# EasyEDA Pro project STM Embedded BD.eprj, board PCB2
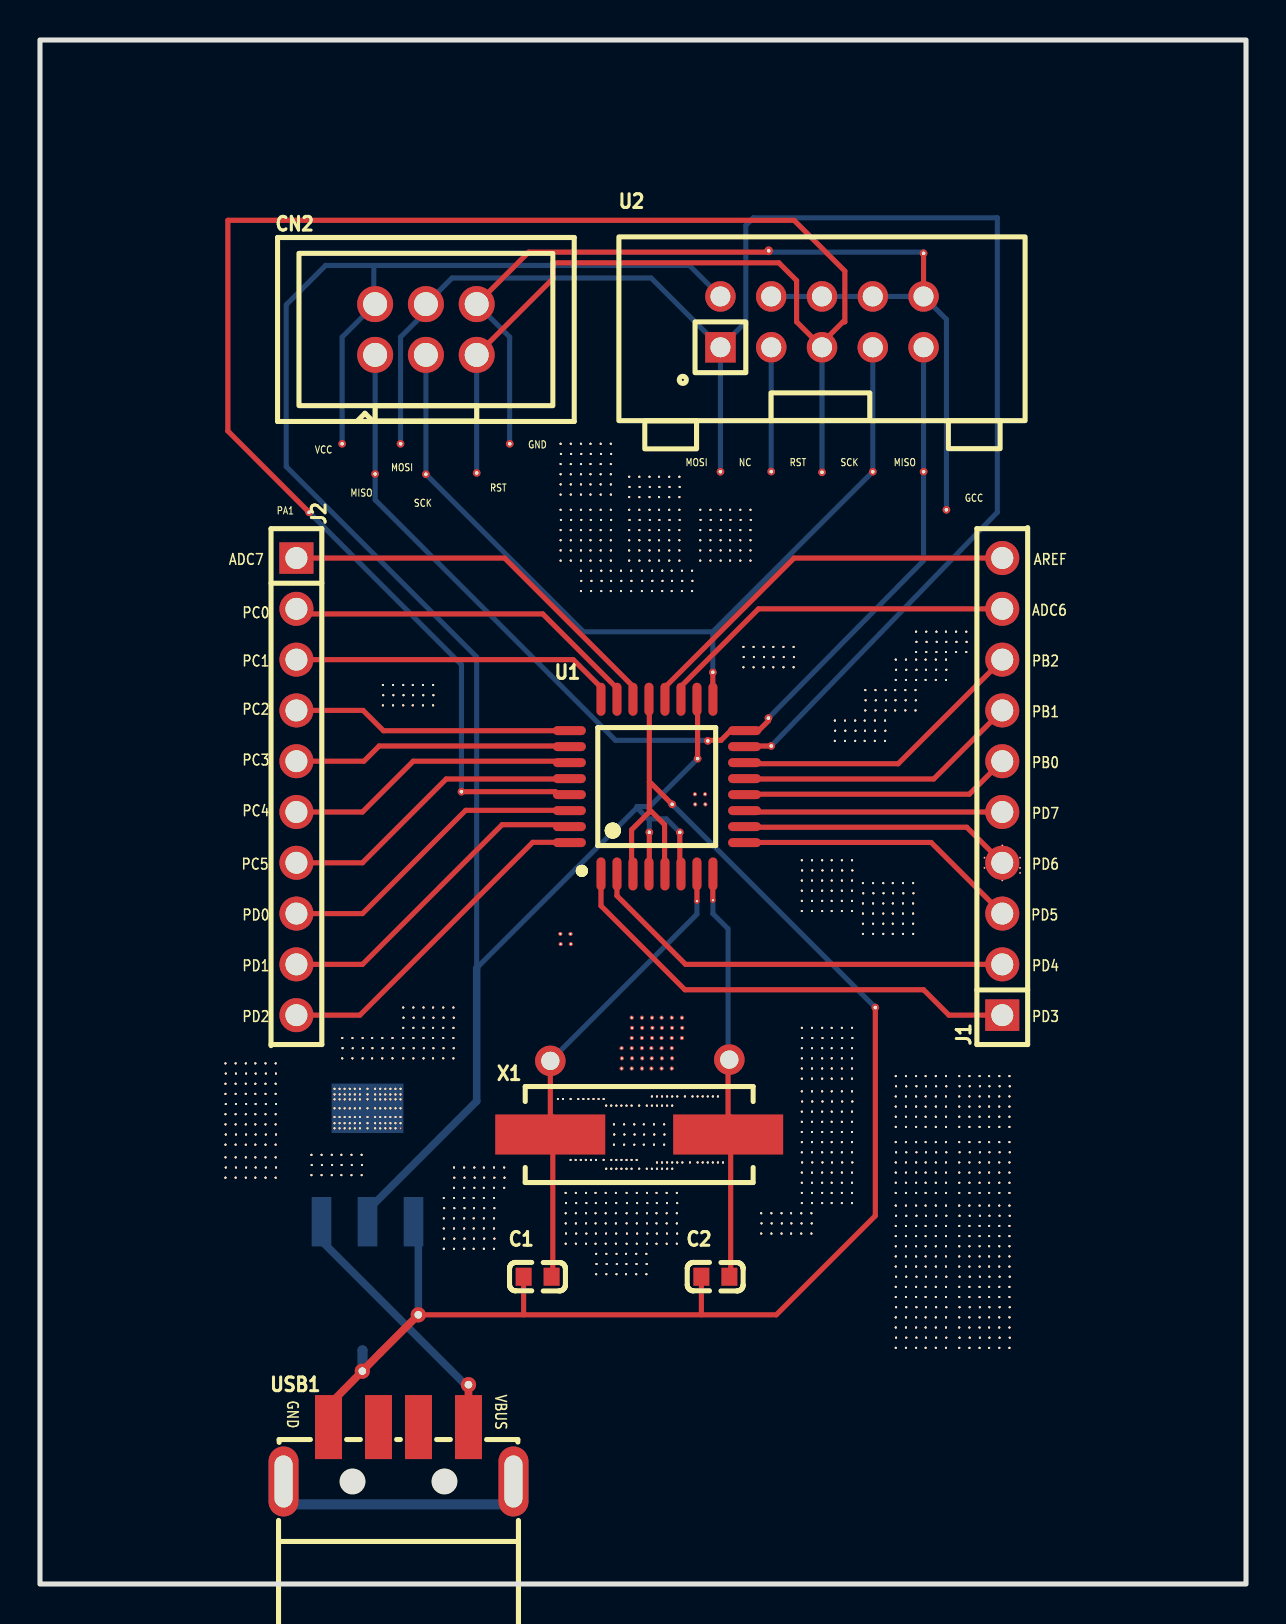
[diagram p4: board, top side]
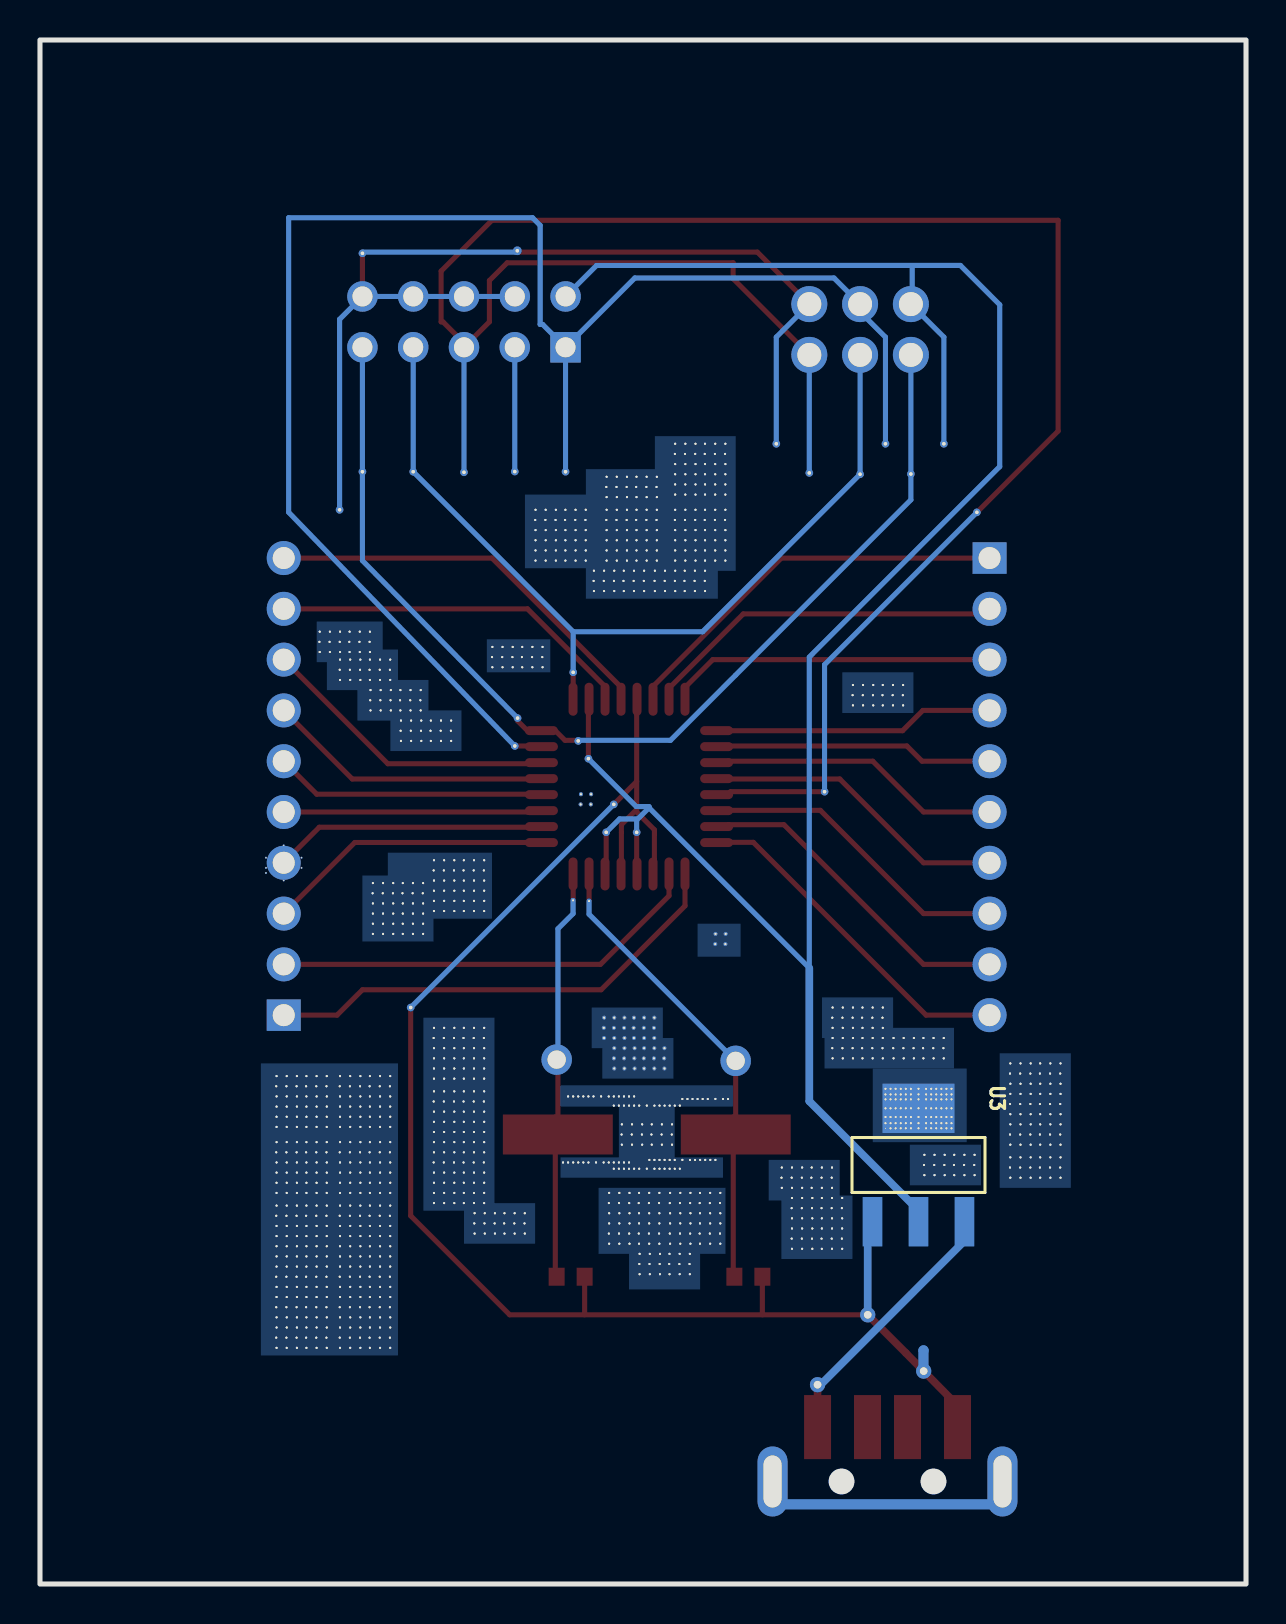
[diagram p5: board, bottom side, seen from below]

Outline 60.32 x 77.22 mm; copper layers: Top Layer, Bottom Layer. Coordinates in mm from the lower left corner of the outline.
Outline path: rectangle 0,77.22 60.32,0
Stack: Top Layer 0.035mm - / Dielectric1 1.51mm FR4 er 4.5 / Bottom Layer 0.035mm -

## Design rules (mm)
template: JLCPCB Capability(Two Layers Board)
spacing copperThickness1oz (default): track to track 0.102, other pairs 0.152 to 0.3
spacing copperThickness2oz: track to track 0.203, other pairs 0.152 to 0.3
track width copperThickness1oz (default): min 0.127, default 0.254, max 2.54
track width copperThickness2oz: min 0.203, default 0.254, max 2.54
differential pair differentialPair (default): width min 0.127, default 0.254, max 2.54; gap min 0.152, default 0.152
via viaSize (default): diameter min 0.5, default 0.61, max 10; hole min 0.3, default 0.305, max 6.3

## Placement (name value [footprint] x y rotation side)
C1  22pF  [C0603]  24.89 15.37 0 top
C2  22pF  [C0603]  33.78 15.37 0 top
CN2  75869-131LF  [CONN-TH_6P-P2.54_75869-131LF]  19.3 62.74 0 top
J1  PZ254-1-10-Z-8.5  [HDR-TH_10P-P2.54-V-M]  48.13 39.88 90 top
J2  PZ254-1-10-Z-8.5  [HDR-TH_10P-P2.54-V-M]  12.83 39.88 270 top
NOREF  -  [Pad_e1230]  30.49 55.37 0 top
NOREF#2  -  [Pad_e957]  28.81 18.54 0 top
NOREF#3  -  [Pad_e325]  45.98 22.1 0 top
NOREF#4  -  [Pad_e1079]  46.49 14.86 0 top
NOREF#5  -  [Pad_e610]  38.62 26.8 0 top
NOREF#6  -  [Pad_e497]  28.04 53.72 0 top
NOREF#7  -  [Pad_e1527]  27.84 16 0 top
NOREF#8  -  [Pad_e822]  27.81 21.21 0 top
NOREF#9  -  [Pad_e817]  26.54 21.21 0 top
NOREF#10  -  [Pad_e44]  42.18 33.02 0 top
NOREF#11  -  [Pad_e963]  31.85 19.56 0 top
NOREF#12  -  [Pad_e595]  34.52 51.69 0 top
NOREF#13  -  [Pad_e1208]  29.06 49.66 0 top
NOREF#14  -  [Pad_e850]  38.11 21.59 0 top
NOREF#15  -  [Pad_e1427]  9.79 22.99 0 top
NOREF#16  -  [Pad_e380]  44.81 16.89 0 top
NOREF#17  -  [Pad_e310]  45.32 19.56 0 top
NOREF#18  -  [Pad_e461]  28.04 57.02 0 top
NOREF#19  -  [Pad_e324]  46.49 22.1 0 top
NOREF#20  -  [Pad_e994]  29.34 18.03 0 top
NOREF#21  -  [Pad_e109]  44.81 23.88 0 top
NOREF#22  -  [Pad_e58]  43.67 32.51 0 top
NOREF#23  -  [Pad_e777]  38.12 24.13 0 top
NOREF#24  -  [Pad_e1325]  45.84 47.12 0 top
NOREF#25  -  [Pad_e1025]  43.31 14.86 0 top
NOREF#26  -  [Pad_e744]  26.16 24.26 0 top
NOREF#27  -  [Pad_e1284]  42.3 44.7 0 top
NOREF#28  -  [Pad_e1070]  47.98 15.88 0 top
NOREF#29  -  [Pad_e1055]  44.82 12.32 0 top
NOREF#30  -  [Pad_e962]  31.35 19.56 0 top
NOREF#31  -  [Pad_e796]  31.88 24.38 0 top
NOREF#32  -  [Pad_e858]  39.12 20.57 0 top
NOREF#33  -  [Pad_e871]  39.6 20.07 0 top
NOREF#34  -  [Pad_e189]  48.49 23.88 0 top
NOREF#35  -  [Pad_e1262]  19.16 43.94 0 top
NOREF#36  -  [Pad_e1029]  45.32 14.86 0 top
NOREF#37  -  [Pad_e615]  40.11 27.81 0 top
NOREF#38  -  [Pad_e523]  27.54 51.69 0 top
NOREF#39  -  [Pad_e663]  15.24 24.48 0 top
NOREF#40  -  [Pad_e1202]  27.58 50.17 0 top
NOREF#41  -  [Pad_e1299]  43.79 43.69 0 top
NOREF#42  -  [Pad_e152]  48.51 24.89 0 top
NOREF#43  -  [Pad_e1265]  40.27 43.18 0 top
NOREF#44  -  [Pad_e419]  47.98 16.38 0 top
NOREF#45  -  [Pad_e502]  27.07 53.21 0 top
NOREF#46  -  [Pad_e1584]  37.09 17.53 0 top
NOREF#47  -  [Pad_e291]  43.33 21.59 0 top
NOREF#48  -  [Pad_e742]  38.63 24.13 0 top
NOREF#49  -  [Pad_e930]  30.22 22.48 0 top
NOREF#50  -  [Pad_e1388]  17.12 26.29 0 top
NOREF#51  -  [Pad_e570]  35.54 53.72 0 top
NOREF#52  -  [Pad_e336]  47.48 20.57 0 top
NOREF#53  -  [Pad_e1135]  30.59 25.78 0 top
NOREF#54  -  [Pad_e392]  48 18.42 0 top
NOREF#55  -  [Pad_e1491]  20.72 20.32 0 top
NOREF#56  -  [Pad_e845]  38.62 22.1 0 top
NOREF#57  -  [Pad_e24]  43.17 34.04 0 top
NOREF#58  -  [Pad_e123]  15.11 57.02 0 top
NOREF#59  -  [Pad_e684]  17.78 24.24 0 top
NOREF#60  -  [Pad_e376]  42.81 16.89 0 top
NOREF#61  -  [Pad_e377]  43.31 16.89 0 top
NOREF#62  -  [Pad_e671]  17.78 24.48 0 top
NOREF#63  -  [Pad_e331]  47.48 21.08 0 top
NOREF#64  -  [Pad_e1477]  21.69 18.29 0 top
NOREF#65  -  [Pad_e80]  43.84 24.89 0 top
NOREF#66  -  [Pad_e797]  32.64 24.38 0 top
NOREF#67  -  [Pad_e1505]  22.22 17.27 0 top
NOREF#68  -  [Pad_e592]  33.03 51.69 0 top
NOREF#69  -  [Pad_e1338]  19.18 27.31 0 top
NOREF#70  -  [Pad_e728]  15.24 22.79 0 top
NOREF#71  -  [Pad_e1200]  28.57 50.17 0 top
NOREF#72  -  [Pad_e192]  47.98 23.88 0 top
NOREF#73  -  [Pad_e1357]  19.66 28.83 0 top
NOREF#74  -  [Pad_e1481]  21.22 20.83 0 top
NOREF#75  -  [Pad_e1248]  18.17 44.96 0 top
NOREF#76  -  [Pad_e1431]  11.79 22.99 0 top
NOREF#77  -  [Pad_e562]  31.98 51.18 0 top
NOREF#78  -  [Pad_e290]  42.82 21.59 0 top
NOREF#79  -  [Pad_e1390]  9.28 26.04 0 top
NOREF#80  -  [Pad_e1429]  10.77 22.99 0 top
NOREF#81  -  [Pad_e55]  42.18 32.51 0 top
NOREF#82  -  [Pad_e565]  30.49 51.18 0 top
NOREF#83  -  [Pad_e1333]  45.32 46.61 0 top
NOREF#84  -  [Pad_e149]  48.49 25.4 0 top
NOREF#85  -  [Pad_e57]  43.17 32.51 0 top
NOREF#86  -  [Pad_e1244]  31.47 54.36 0 top
NOREF#87  -  [Pad_e1499]  20.71 17.78 0 top
NOREF#88  -  [Pad_e1024]  42.81 14.86 0 top
NOREF#89  -  [Pad_e349]  47 19.56 0 top
NOREF#90  -  [Pad_e1493]  21.22 19.81 0 top
NOREF#91  -  [Pad_e389]  47.98 18.92 0 top
NOREF#92  -  [Pad_e1086]  47 14.35 0 top
NOREF#93  -  [Pad_e1417]  10.31 24 0 top
NOREF#94  -  [Pad_e1577]  38.09 18.03 0 top
NOREF#95  -  [Pad_e947]  28.31 19.05 0 top
NOREF#96  -  [Pad_e828]  29.84 21.21 0 top
NOREF#97  -  [Pad_e788]  40.62 23.62 0 top
NOREF#98  -  [Pad_e481]  27.06 55.5 0 top
NOREF#99  -  [Pad_e1296]  42.3 43.69 0 top
NOREF#100  -  [Pad_e642]  47.24 36.32 0 top
NOREF#101  -  [Pad_e1253]  19.17 44.45 0 top
NOREF#102  -  [Pad_e1063]  44.3 11.81 0 top
NOREF#103  -  [Pad_e810]  32.89 21.08 0 top
NOREF#104  -  [Pad_e1228]  29.47 55.37 0 top
NOREF#105  -  [Pad_e564]  30.97 51.18 0 top
NOREF#106  -  [Pad_e621]  38.11 26.29 0 top
NOREF#107  -  [Pad_e800]  33.4 24.38 0 top
NOREF#108  -  [Pad_e1185]  35.2 46.36 0 top
NOREF#109  -  [Pad_e630]  39.12 25.78 0 top
NOREF#110  -  [Pad_e569]  35.03 53.72 0 top
NOREF#111  -  [Pad_e649]  15.24 24.77 0 top
NOREF#112  -  [Pad_e1066]  45.98 15.88 0 top
NOREF#113  -  [Pad_e1410]  10.29 24.51 0 top
NOREF#114  -  [Pad_e423]  45.98 16.38 0 top
NOREF#115  -  [Pad_e328]  45.98 21.08 0 top
NOREF#116  -  [Pad_e991]  27.79 17.02 0 top
NOREF#117  -  [Pad_e442]  38.62 34.67 0 top
NOREF#118  -  [Pad_e1305]  45.32 46.23 0 top
NOREF#119  -  [Pad_e372]  44.3 17.4 0 top
NOREF#120  -  [Pad_e1406]  11.28 25.02 0 top
NOREF#121  -  [Pad_e1251]  19.66 44.96 0 top
NOREF#122  -  [Pad_e549]  31.98 52.71 0 top
NOREF#123  -  [Pad_e318]  48.49 22.1 0 top
NOREF#124  -  [Pad_e1287]  43.79 44.7 0 top
NOREF#125  -  [Pad_e1382]  15.64 26.8 0 top
NOREF#126  -  [Pad_e1091]  48 13.84 0 top
NOREF#127  -  [Pad_e1362]  19.68 28.32 0 top
NOREF#128  -  [Pad_e700]  14.73 23.35 0 top
NOREF#129  -  [Pad_e1239]  29.49 54.86 0 top
NOREF#130  -  [Pad_e1593]  26.54 32.51 0 top
NOREF#131  -  [Pad_e1353]  20.68 26.29 0 top
NOREF#132  -  [Pad_e769]  29.34 23.92 0 top
NOREF#133  -  [Pad_e705]  16 23.35 0 top
NOREF#134  -  [Pad_e462]  28.55 57.02 0 top
NOREF#135  -  [Pad_e1093]  47.01 13.84 0 top
NOREF#136  -  [Pad_e602]  33.54 51.18 0 top
NOREF#137  -  [Pad_e360]  43.31 18.92 0 top
NOREF#138  -  [Pad_e443]  39.12 34.67 0 top
NOREF#139  -  [Pad_e1047]  45.32 13.34 0 top
NOREF#140  -  [Pad_e692]  16 23.79 0 top
NOREF#141  -  [Pad_e1533]  30.33 15.49 0 top
NOREF#142  -  [Pad_e1482]  21.72 20.83 0 top
NOREF#143  -  [Pad_e622]  38.62 26.29 0 top
NOREF#144  -  [Pad_e2356]  32.86 34.15 0 top
NOREF#145  -  [Pad_e138]  44.81 22.86 0 top
NOREF#146  -  [Pad_e412]  45.98 16.89 0 top
NOREF#147  -  [Pad_e469]  26.04 57.02 0 top
NOREF#148  -  [Pad_e720]  17.02 23.04 0 top
NOREF#149  -  [Pad_e1443]  11.79 21.97 0 top
NOREF#150  -  [Pad_e1367]  18.68 27.81 0 top
NOREF#151  -  [Pad_e1133]  29.6 25.78 0 top
NOREF#152  -  [Pad_e1268]  41.76 43.18 0 top
NOREF#153  -  [Pad_e702]  15.24 23.35 0 top
NOREF#154  -  [Pad_e1279]  41.25 42.16 0 top
NOREF#155  -  [Pad_e1511]  20.71 16.76 0 top
NOREF#156  -  [Pad_e413]  46.49 16.89 0 top
NOREF#157  -  [Pad_e1259]  17.66 43.94 0 top
NOREF#158  -  [Pad_e541]  29.47 53.72 0 top
NOREF#159  -  [Pad_e1508]  20.72 17.27 0 top
NOREF#160  -  [Pad_e525]  28.55 51.69 0 top
NOREF#161  -  [Pad_e1356]  19.18 28.83 0 top
NOREF#162  -  [Pad_e282]  45.32 22.1 0 top
NOREF#163  -  [Pad_e329]  46.49 21.08 0 top
NOREF#164  -  [Pad_e1003]  30.38 17.53 0 top
NOREF#165  -  [Pad_e1007]  29.85 17.02 0 top
NOREF#166  -  [Pad_e515]  28.04 52.2 0 top
NOREF#167  -  [Pad_e198]  47.48 23.88 0 top
NOREF#168  -  [Pad_e393]  47.49 18.42 0 top
NOREF#169  -  [Pad_e385]  43.82 16.38 0 top
NOREF#170  -  [Pad_e1237]  30.5 54.86 0 top
NOREF#171  -  [Pad_e1446]  10.29 21.34 0 top
NOREF#172  -  [Pad_e563]  31.47 51.18 0 top
NOREF#173  -  [Pad_e382]  45.32 16.38 0 top
NOREF#174  -  [Pad_e1302]  43.82 46.23 0 top
NOREF#175  -  [Pad_e1243]  30.97 54.36 0 top
NOREF#176  -  [Pad_e1152]  30.61 27.31 0 top
NOREF#177  -  [Pad_e757]  29.59 20.77 0 top
NOREF#178  -  [Pad_e172]  45.98 25.4 0 top
NOREF#179  -  [Pad_e305]  43.31 20.07 0 top
NOREF#180  -  [Pad_e712]  16.38 23.05 0 top
NOREF#181  -  [Pad_e660]  16.38 24.49 0 top
NOREF#182  -  [Pad_e399]  46.5 18.42 0 top
NOREF#183  -  [Pad_e724]  18.03 23.04 0 top
NOREF#184  -  [Pad_e453]  38.11 33.66 0 top
NOREF#185  -  [Pad_e103]  32.89 41.28 0 top
NOREF#186  -  [Pad_e1179]  37.7 46.86 0 top
NOREF#187  -  [Pad_e710]  17.78 23.35 0 top
NOREF#188  -  [Pad_e1436]  9.8 22.48 0 top
NOREF#189  -  [Pad_e675]  14.99 24.24 0 top
NOREF#190  -  [Pad_e368]  44.81 17.91 0 top
NOREF#191  -  [Pad_e397]  45.98 18.92 0 top
NOREF#192  -  [Pad_e311]  44.81 19.56 0 top
NOREF#193  -  [Pad_e1168]  13.58 20.45 0 top
NOREF#194  -  [Pad_e1515]  22.71 16.76 0 top
NOREF#195  -  [Pad_e704]  15.75 23.35 0 top
NOREF#196  -  [Pad_e669]  17.27 24.48 0 top
NOREF#197  -  [Pad_e1271]  41.78 42.67 0 top
NOREF#198  -  [Pad_e1369]  19.66 27.81 0 top
NOREF#199  -  [Pad_e1408]  9.28 24.51 0 top
NOREF#200  -  [Pad_e1141]  31.09 28.32 0 top
NOREF#201  -  [Pad_e186]  36.44 43.3 0 top
NOREF#202  -  [Pad_e1464]  21.22 19.3 0 top
NOREF#203  -  [Pad_e390]  48.49 18.92 0 top
NOREF#204  -  [Pad_e1589]  33.27 39.5 0 top
NOREF#205  -  [Pad_e373]  43.82 17.4 0 top
NOREF#206  -  [Pad_e496]  27.54 53.72 0 top
NOREF#207  -  [Pad_e1399]  10.31 25.53 0 top
NOREF#208  -  [Pad_e1064]  44.81 11.81 0 top
NOREF#209  -  [Pad_e966]  30.85 19.05 0 top
NOREF#210  -  [Pad_e452]  38.11 34.16 0 top
NOREF#211  -  [Pad_e1294]  41.28 43.69 0 top
NOREF#212  -  [Pad_e928]  31.23 22.48 0 top
NOREF#213  -  [Pad_e185]  33.4 42.16 0 top
NOREF#214  -  [Pad_e1035]  45.32 14.35 0 top
NOREF#215  -  [Pad_e1124]  31.09 26.8 0 top
NOREF#216  -  [Pad_e1178]  37.19 46.86 0 top
NOREF#217  -  [Pad_e474]  27.06 56.01 0 top
NOREF#218  -  [Pad_e1514]  22.2 16.76 0 top
NOREF#219  -  [Pad_e1400]  9.8 25.53 0 top
NOREF#220  -  [Pad_e865]  40.62 21.59 0 top
NOREF#221  -  [Pad_e716]  15.49 23.04 0 top
NOREF#222  -  [Pad_e500]  28.06 53.21 0 top
NOREF#223  -  [Pad_e306]  43.82 20.07 0 top
NOREF#224  -  [Pad_e1046]  44.81 13.34 0 top
NOREF#225  -  [Pad_e378]  43.82 16.89 0 top
NOREF#226  -  [Pad_e838]  40.62 22.61 0 top
NOREF#227  -  [Pad_e860]  39.62 21.08 0 top
NOREF#228  -  [Pad_e1273]  40.79 42.67 0 top
NOREF#229  -  [Pad_e1307]  44.82 45.72 0 top
NOREF#230  -  [Pad_e761]  31.12 20.77 0 top
NOREF#231  -  [Pad_e1512]  21.22 16.76 0 top
NOREF#232  -  [Pad_e366]  43.82 17.91 0 top
NOREF#233  -  [Pad_e556]  29.47 51.69 0 top
NOREF#234  -  [Pad_e1068]  47 15.88 0 top
NOREF#235  -  [Pad_e22]  42.18 34.04 0 top
NOREF#236  -  [Pad_e1403]  9.79 25.02 0 top
NOREF#237  -  [Pad_e596]  35.03 51.69 0 top
NOREF#238  -  [Pad_e1459]  10.77 20.32 0 top
NOREF#239  -  [Pad_e1513]  21.69 16.76 0 top
NOREF#240  -  [Pad_e1215]  32.62 50.67 0 top
NOREF#241  -  [Pad_e603]  33.03 51.18 0 top
NOREF#242  -  [Pad_e520]  26.04 51.69 0 top
NOREF#243  -  [Pad_e645]  48.13 35.19 0 top
NOREF#244  -  [Pad_e1349]  18.68 26.29 0 top
NOREF#245  -  [Pad_e409]  47 17.4 0 top
NOREF#246  -  [Pad_e926]  30.71 22.99 0 top
NOREF#247  -  [Pad_e213]  21.08 39.62 0 top
NOREF#248  -  [Pad_e703]  15.49 23.35 0 top
NOREF#249  -  [Pad_e1218]  31.62 50.17 0 top
NOREF#250  -  [Pad_e968]  29.87 19.05 0 top
NOREF#251  -  [Pad_e106]  44.81 24.38 0 top
NOREF#252  -  [Pad_e64]  42.18 35.05 0 top
NOREF#253  -  [Pad_e1378]  17.65 26.8 0 top
NOREF#254  -  [Pad_e417]  48.49 16.89 0 top
NOREF#255  -  [Pad_e771]  30.35 23.92 0 top
NOREF#256  -  [Pad_e1027]  44.3 14.86 0 top
NOREF#257  -  [Pad_e584]  35.03 52.71 0 top
NOREF#258  -  [Pad_e1290]  42.79 44.2 0 top
NOREF#259  -  [Pad_e2]  43.69 34.54 0 top
NOREF#260  -  [Pad_e1345]  19.2 26.8 0 top
NOREF#261  -  [Pad_e1346]  18.69 26.8 0 top
NOREF#262  -  [Pad_e778]  38.11 23.62 0 top
NOREF#263  -  [Pad_e1275]  39.77 42.67 0 top
NOREF#264  -  [Pad_e852]  39.12 21.59 0 top
NOREF#265  -  [Pad_e958]  29.34 19.56 0 top
NOREF#266  -  [Pad_e1256]  17.67 44.45 0 top
NOREF#267  -  [Pad_e367]  44.3 17.91 0 top
NOREF#268  -  [Pad_e1130]  29.61 26.29 0 top
NOREF#269  -  [Pad_e1466]  22.2 19.3 0 top
NOREF#270  -  [Pad_e689]  15.24 23.79 0 top
NOREF#271  -  [Pad_e1323]  46.33 47.63 0 top
NOREF#272  -  [Pad_e783]  39.6 24.64 0 top
NOREF#273  -  [Pad_e362]  42.82 18.42 0 top
NOREF#274  -  [Pad_e1389]  17.63 26.29 0 top
NOREF#275  -  [Pad_e531]  26.04 51.18 0 top
NOREF#276  -  [Pad_e73]  44.3 25.4 0 top
NOREF#277  -  [Pad_e643]  49.02 36.32 0 top
NOREF#278  -  [Pad_e536]  31.49 53.21 0 top
NOREF#279  -  [Pad_e672]  18.03 24.48 0 top
NOREF#280  -  [Pad_e658]  16.76 24.77 0 top
NOREF#281  -  [Pad_e1586]  38.08 17.53 0 top
NOREF#282  -  [Pad_e648]  14.99 24.77 0 top
NOREF#283  -  [Pad_e1056]  44.32 12.32 0 top
NOREF#284  -  [Pad_e115]  43.31 23.88 0 top
NOREF#285  -  [Pad_e1373]  15.63 27.31 0 top
NOREF#286  -  [Pad_e542]  29.49 53.21 0 top
NOREF#287  -  [Pad_e296]  44.81 21.08 0 top
NOREF#288  -  [Pad_e820]  27.31 21.21 0 top
NOREF#289  -  [Pad_e874]  40.62 19.56 0 top
NOREF#290  -  [Pad_e430]  38.62 35.18 0 top
NOREF#291  -  [Pad_e690]  15.49 23.79 0 top
NOREF#292  -  [Pad_e791]  30.61 24.38 0 top
NOREF#293  -  [Pad_e1203]  27.07 50.17 0 top
NOREF#294  -  [Pad_e627]  40.62 25.78 0 top
NOREF#295  -  [Pad_e3]  42.67 34.54 0 top
NOREF#296  -  [Pad_e1309]  43.84 45.72 0 top
NOREF#297  -  [Pad_e768]  29.08 23.92 0 top
NOREF#298  -  [Pad_e1434]  10.79 22.48 0 top
NOREF#299  -  [Pad_e369]  45.32 17.91 0 top
NOREF#300  -  [Pad_e863]  40.12 21.08 0 top
NOREF#301  -  [Pad_e1225]  31.6 49.66 0 top
NOREF#302  -  [Pad_e457]  40.11 33.66 0 top
NOREF#303  -  [Pad_e885]  40.62 19.05 0 top
NOREF#304  -  [Pad_e69]  42.66 35.05 0 top
NOREF#305  -  [Pad_e113]  44.3 23.88 0 top
NOREF#306  -  [Pad_e1510]  20.2 16.76 0 top
NOREF#307  -  [Pad_e983]  28.31 17.53 0 top
NOREF#308  -  [Pad_e1496]  22.71 19.81 0 top
NOREF#309  -  [Pad_e425]  39.12 36.2 0 top
NOREF#310  -  [Pad_e1194]  28.07 50.67 0 top
NOREF#311  -  [Pad_e1181]  37.2 46.36 0 top
NOREF#312  -  [Pad_e1276]  39.76 42.16 0 top
NOREF#313  -  [Pad_e1177]  36.68 46.86 0 top
NOREF#314  -  [Pad_e965]  31.36 19.05 0 top
NOREF#315  -  [Pad_e1250]  19.16 44.96 0 top
NOREF#316  -  [Pad_e352]  44.3 18.92 0 top
NOREF#317  -  [Pad_e1465]  21.69 19.3 0 top
NOREF#318  -  [Pad_e770]  29.59 23.92 0 top
NOREF#319  -  [Pad_e628]  40.11 25.78 0 top
NOREF#320  -  [Pad_e355]  45.33 18.42 0 top
NOREF#321  -  [Pad_e364]  42.81 17.91 0 top
NOREF#322  -  [Pad_e1455]  9.29 20.83 0 top
NOREF#323  -  [Pad_e733]  17.02 22.79 0 top
NOREF#324  -  [Pad_e447]  40.62 34.16 0 top
NOREF#325  -  [Pad_e1144]  32.12 27.81 0 top
NOREF#326  -  [Pad_e751]  29.97 20.77 0 top
NOREF#327  -  [Pad_e388]  47.48 18.92 0 top
NOREF#328  -  [Pad_e618]  40.62 27.81 0 top
NOREF#329  -  [Pad_e1420]  9.28 23.5 0 top
NOREF#330  -  [Pad_e1377]  17.63 27.31 0 top
NOREF#331  -  [Pad_e967]  30.38 19.05 0 top
NOREF#332  -  [Pad_e1522]  30.35 16 0 top
NOREF#333  -  [Pad_e713]  14.73 23.04 0 top
NOREF#334  -  [Pad_e1071]  48.49 15.88 0 top
NOREF#335  -  [Pad_e980]  28.3 18.03 0 top
NOREF#336  -  [Pad_e1216]  32.63 50.17 0 top
NOREF#337  -  [Pad_e1360]  20.69 28.32 0 top
NOREF#338  -  [Pad_e300]  44.3 20.57 0 top
NOREF#339  -  [Pad_e5]  41.69 34.54 0 top
NOREF#340  -  [Pad_e1286]  43.28 44.7 0 top
NOREF#341  -  [Pad_e1092]  47.49 13.84 0 top
NOREF#342  -  [Pad_e1401]  9.29 25.53 0 top
NOREF#343  -  [Pad_e1441]  10.77 21.97 0 top
NOREF#344  -  [Pad_e946]  28.82 19.05 0 top
NOREF#345  -  [Pad_e1090]  48.51 13.84 0 top
NOREF#346  -  [Pad_e1433]  11.3 22.48 0 top
NOREF#347  -  [Pad_e1298]  43.28 43.69 0 top
NOREF#348  -  [Pad_e99]  43.31 24.38 0 top
NOREF#349  -  [Pad_e1497]  23.22 19.81 0 top
NOREF#350  -  [Pad_e124]  18.03 57.02 0 top
NOREF#351  -  [Pad_e1233]  31.98 55.37 0 top
NOREF#352  -  [Pad_e781]  39.6 23.62 0 top
NOREF#353  -  [Pad_e1303]  44.3 46.23 0 top
NOREF#354  -  [Pad_e776]  31.62 23.92 0 top
NOREF#355  -  [Pad_e656]  17.27 24.77 0 top
NOREF#356  -  [Pad_e719]  16.76 23.04 0 top
NOREF#357  -  [Pad_e158]  23.5 57.02 0 top
NOREF#358  -  [Pad_e1072]  48.51 15.37 0 top
NOREF#359  -  [Pad_e1204]  27.06 49.66 0 top
NOREF#360  -  [Pad_e1404]  10.29 25.02 0 top
NOREF#361  -  [Pad_e1525]  28.85 16 0 top
NOREF#362  -  [Pad_e289]  42.81 22.1 0 top
NOREF#363  -  [Pad_e1444]  9.28 21.34 0 top
NOREF#364  -  [Pad_e1171]  15.07 20.45 0 top
NOREF#365  -  [Pad_e1595]  26.04 32 0 top
NOREF#366  -  [Pad_e345]  48.49 20.07 0 top
NOREF#367  -  [Pad_e1430]  11.28 22.99 0 top
NOREF#368  -  [Pad_e176]  45.98 24.38 0 top
NOREF#369  -  [Pad_e632]  38.11 25.78 0 top
NOREF#370  -  [Pad_e1157]  14.09 21.46 0 top
NOREF#371  -  [Pad_e575]  34.04 53.72 0 top
NOREF#372  -  [Pad_e1285]  42.78 44.7 0 top
NOREF#373  -  [Pad_e280]  44.3 22.1 0 top
NOREF#374  -  [Pad_e1189]  36.68 45.85 0 top
NOREF#375  -  [Pad_e2357]  33.66 34.19 0 top
NOREF#376  -  [Pad_e108]  45.32 23.88 0 top
NOREF#377  -  [Pad_e1100]  47.98 13.34 0 top
NOREF#378  -  [Pad_e179]  33.66 45.59 0 top
NOREF#379  -  [Pad_e1439]  9.79 21.97 0 top
NOREF#380  -  [Pad_e780]  39.12 23.62 0 top
NOREF#381  -  [Pad_e1310]  43.33 45.72 0 top
NOREF#382  -  [Pad_e1089]  48.49 14.35 0 top
NOREF#383  -  [Pad_e699]  16.38 23.36 0 top
NOREF#384  -  [Pad_e843]  38.11 22.61 0 top
NOREF#385  -  [Pad_e271]  47.98 22.86 0 top
NOREF#386  -  [Pad_e650]  15.49 24.77 0 top
NOREF#387  -  [Pad_e956]  28.3 18.54 0 top
NOREF#388  -  [Pad_e1126]  31.62 26.29 0 top
NOREF#389  -  [Pad_e1098]  47 13.34 0 top
NOREF#390  -  [Pad_e1172]  15.58 20.45 0 top
NOREF#391  -  [Pad_e1018]  45.33 15.37 0 top
NOREF#392  -  [Pad_e1074]  47.49 15.37 0 top
NOREF#393  -  [Pad_e604]  38.62 27.81 0 top
NOREF#394  -  [Pad_e398]  46 18.42 0 top
NOREF#395  -  [Pad_e1348]  18.17 26.29 0 top
NOREF#396  -  [Pad_e150]  44.2 55.63 0 top
NOREF#397  -  [Pad_e1277]  40.27 42.16 0 top
NOREF#398  -  [Pad_e143]  34.04 55.63 0 top
NOREF#399  -  [Pad_e1334]  45.82 46.61 0 top
NOREF#400  -  [Pad_e755]  29.08 20.77 0 top
NOREF#401  -  [Pad_e428]  38.12 35.69 0 top
NOREF#402  -  [Pad_e1351]  19.66 26.29 0 top
NOREF#403  -  [Pad_e516]  27.54 52.2 0 top
NOREF#404  -  [Pad_e715]  15.24 23.04 0 top
NOREF#405  -  [Pad_e679]  16 24.24 0 top
NOREF#406  -  [Pad_e322]  47.01 21.59 0 top
NOREF#407  -  [Pad_e1329]  43.84 47.12 0 top
NOREF#408  -  [Pad_e636]  39.6 25.27 0 top
NOREF#409  -  [Pad_e731]  16 22.79 0 top
NOREF#410  -  [Pad_e696]  17.53 23.79 0 top
NOREF#411  -  [Pad_e25]  43.67 34.04 0 top
NOREF#412  -  [Pad_e969]  29.36 19.05 0 top
NOREF#413  -  [Pad_e867]  40.11 20.57 0 top
NOREF#414  -  [Pad_e222]  47 23.37 0 top
NOREF#415  -  [Pad_e203]  36.45 66.68 0 top
NOREF#416  -  [Pad_e576]  33.54 53.72 0 top
NOREF#417  -  [Pad_e1101]  48.49 13.34 0 top
NOREF#418  -  [Pad_e558]  30.49 51.69 0 top
NOREF#419  -  [Pad_e1045]  44.3 13.34 0 top
NOREF#420  -  [Pad_e750]  28.19 24.26 0 top
NOREF#421  -  [Pad_e651]  15.75 24.77 0 top
NOREF#422  -  [Pad_e1034]  44.81 14.35 0 top
NOREF#423  -  [Pad_e1016]  44.81 15.88 0 top
NOREF#424  -  [Pad_e546]  30.49 52.71 0 top
NOREF#425  -  [Pad_e79]  44.32 24.89 0 top
NOREF#426  -  [Pad_e582]  34.04 52.71 0 top
NOREF#427  -  [Pad_e1426]  9.28 22.99 0 top
NOREF#428  -  [Pad_e164]  47.01 24.89 0 top
NOREF#429  -  [Pad_e1097]  46.49 13.34 0 top
NOREF#430  -  [Pad_e421]  47 16.38 0 top
NOREF#431  -  [Pad_e884]  40.11 19.05 0 top
NOREF#432  -  [Pad_e1347]  18.18 26.8 0 top
NOREF#433  -  [Pad_e1209]  29.57 49.66 0 top
NOREF#434  -  [Pad_e945]  28.81 19.56 0 top
NOREF#435  -  [Pad_e687]  14.73 23.79 0 top
NOREF#436  -  [Pad_e825]  29.08 21.21 0 top
NOREF#437  -  [Pad_e748]  27.69 24.26 0 top
NOREF#438  -  [Pad_e84]  18.92 13.46 0 top
NOREF#439  -  [Pad_e1484]  22.71 20.83 0 top
NOREF#440  -  [Pad_e495]  26.04 54.48 0 top
NOREF#441  -  [Pad_e1212]  31.12 50.67 0 top
NOREF#442  -  [Pad_e924]  29.73 22.99 0 top
NOREF#443  -  [Pad_e883]  39.6 19.05 0 top
NOREF#444  -  [Pad_e802]  33.91 24.38 0 top
NOREF#445  -  [Pad_e1198]  29.58 50.17 0 top
NOREF#446  -  [Pad_e1580]  36.6 18.03 0 top
NOREF#447  -  [Pad_e374]  43.31 17.4 0 top
NOREF#448  -  [Pad_e1528]  27.82 15.49 0 top
NOREF#449  -  [Pad_e449]  39.6 34.16 0 top
NOREF#450  -  [Pad_e183]  47.98 24.38 0 top
NOREF#451  -  [Pad_e1386]  16.14 26.29 0 top
NOREF#452  -  [Pad_e485]  26.55 54.99 0 top
NOREF#453  -  [Pad_e1336]  18.17 27.31 0 top
NOREF#454  -  [Pad_e1096]  45.98 13.34 0 top
NOREF#455  -  [Pad_e934]  28.71 21.97 0 top
NOREF#456  -  [Pad_e1380]  16.63 26.8 0 top
NOREF#457  -  [Pad_e1083]  48.49 14.86 0 top
NOREF#458  -  [Pad_e1193]  27.57 50.67 0 top
NOREF#459  -  [Pad_e818]  26.8 21.21 0 top
NOREF#460  -  [Pad_e1449]  11.79 21.34 0 top
NOREF#461  -  [Pad_e605]  39.12 27.81 0 top
NOREF#462  -  [Pad_e441]  38.11 34.67 0 top
NOREF#463  -  [Pad_e951]  26.31 19.05 0 top
NOREF#464  -  [Pad_e674]  14.73 24.24 0 top
NOREF#465  -  [Pad_e487]  27.54 54.99 0 top
NOREF#466  -  [Pad_e415]  47.48 16.89 0 top
NOREF#467  -  [Pad_e986]  26.82 17.53 0 top
NOREF#468  -  [Pad_e606]  39.14 27.31 0 top
NOREF#469  -  [Pad_e938]  30.71 21.97 0 top
NOREF#470  -  [Pad_e468]  26.55 57.02 0 top
NOREF#471  -  [Pad_e1358]  20.17 28.83 0 top
NOREF#472  -  [Pad_e698]  18.03 23.79 0 top
NOREF#473  -  [Pad_e624]  39.6 26.29 0 top
NOREF#474  -  [Pad_e1108]  48.51 12.32 0 top
NOREF#475  -  [Pad_e317]  47.98 22.1 0 top
NOREF#476  -  [Pad_e1398]  10.79 25.53 0 top
NOREF#477  -  [Pad_e459]  38.11 27.81 0 top
NOREF#478  -  [Pad_e219]  46.49 23.37 0 top
NOREF#479  -  [Pad_e933]  28.72 22.48 0 top
NOREF#480  -  [Pad_e1291]  42.31 44.2 0 top
NOREF#481  -  [Pad_e1036]  45.33 13.84 0 top
NOREF#482  -  [Pad_e1169]  14.09 20.45 0 top
NOREF#483  -  [Pad_e5733]  16.12 10.65 0 top
NOREF#484  -  [Pad_e1393]  10.77 26.04 0 top
NOREF#485  -  [Pad_e847]  39.6 22.1 0 top
NOREF#486  -  [Pad_e1221]  30.12 50.17 0 top
NOREF#487  -  [Pad_e56]  42.66 32.51 0 top
NOREF#488  -  [Pad_e53]  41.67 32.51 0 top
NOREF#489  -  [Pad_e1183]  36.22 46.36 0 top
NOREF#490  -  [Pad_e1137]  31.6 25.78 0 top
NOREF#491  -  [Pad_e1166]  14.1 20.96 0 top
NOREF#492  -  [Pad_e350]  46.49 19.56 0 top
NOREF#493  -  [Pad_e629]  39.6 25.78 0 top
NOREF#494  -  [Pad_e772]  30.61 23.92 0 top
NOREF#495  -  [Pad_e880]  38.11 19.05 0 top
NOREF#496  -  [Pad_e126]  16.76 55.51 0 top
NOREF#497  -  [Pad_e1340]  20.17 27.31 0 top
NOREF#498  -  [Pad_e851]  38.62 21.59 0 top
NOREF#499  -  [Pad_e666]  16 24.48 0 top
NOREF#500  -  [Pad_e942]  27.31 19.56 0 top
NOREF#501  -  [Pad_e75]  45.32 25.4 0 top
NOREF#502  -  [Pad_e992]  28.3 17.02 0 top
NOREF#503  -  [Pad_e139]  44.3 22.86 0 top
NOREF#504  -  [Pad_e297]  45.32 21.08 0 top
NOREF#505  -  [Pad_e682]  17.27 24.24 0 top
NOREF#506  -  [Pad_e574]  34.06 53.21 0 top
NOREF#507  -  [Pad_e140]  43.82 22.86 0 top
NOREF#508  -  [Pad_e1139]  30.11 28.32 0 top
NOREF#509  -  [Pad_e130]  21.84 55.57 0 top
NOREF#510  -  [Pad_e1115]  46.49 11.81 0 top
NOREF#511  -  [Pad_e341]  46.49 20.07 0 top
NOREF#512  -  [Pad_e1335]  46.33 46.61 0 top
NOREF#513  -  [Pad_e526]  28.55 51.18 0 top
NOREF#514  -  [Pad_e726]  14.73 22.79 0 top
NOREF#515  -  [Pad_e836]  40.11 23.11 0 top
NOREF#516  -  [Pad_e403]  47.48 17.91 0 top
NOREF#517  -  [Pad_e1174]  35.19 46.86 0 top
NOREF#518  -  [Pad_e683]  17.53 24.24 0 top
NOREF#519  -  [Pad_e1182]  36.7 46.36 0 top
NOREF#520  -  [Pad_e1272]  41.27 42.67 0 top
NOREF#521  -  [Pad_e721]  17.27 23.04 0 top
NOREF#522  -  [Pad_e131]  44.81 23.37 0 top
NOREF#523  -  [Pad_e1143]  32.11 28.32 0 top
NOREF#524  -  [Pad_e383]  44.81 16.38 0 top
NOREF#525  -  [Pad_e1033]  44.3 14.35 0 top
NOREF#526  -  [Pad_e4]  41.18 34.54 0 top
NOREF#527  -  [Pad_e1087]  47.48 14.35 0 top
NOREF#528  -  [Pad_e697]  17.78 23.79 0 top
NOREF#529  -  [Pad_e637]  40.11 25.27 0 top
NOREF#530  -  [Pad_e1321]  45.32 47.63 0 top
NOREF#531  -  [Pad_e518]  26.55 52.2 0 top
NOREF#532  -  [Pad_e427]  38.63 35.69 0 top
NOREF#533  -  [Pad_e1281]  42.27 42.16 0 top
NOREF#534  -  [Pad_e1186]  35.19 45.85 0 top
NOREF#535  -  [Pad_e1175]  35.69 46.86 0 top
NOREF#536  -  [Pad_e974]  31.35 18.54 0 top
NOREF#537  -  [Pad_e465]  27.55 56.52 0 top
NOREF#538  -  [Pad_e677]  15.49 24.24 0 top
NOREF#539  -  [Pad_e984]  27.81 17.53 0 top
NOREF#540  -  [Pad_e40]  41.16 33.02 0 top
NOREF#541  -  [Pad_e1582]  36.08 17.53 0 top
NOREF#542  -  [Pad_e1328]  44.34 47.12 0 top
NOREF#543  -  [Pad_e478]  28.55 55.5 0 top
NOREF#544  -  [Pad_e1461]  11.79 20.32 0 top
NOREF#545  -  [Pad_e225]  48.49 23.37 0 top
NOREF#546  -  [Pad_e83]  43.31 25.4 0 top
NOREF#547  -  [Pad_e826]  29.34 21.21 0 top
NOREF#548  -  [Pad_e798]  32.89 24.38 0 top
NOREF#549  -  [Pad_e608]  38.12 27.31 0 top
NOREF#550  -  [Pad_e586]  35.54 52.2 0 top
NOREF#551  -  [Pad_e1017]  45.32 15.88 0 top
NOREF#552  -  [Pad_e676]  15.24 24.24 0 top
NOREF#553  -  [Pad_e410]  46.49 17.4 0 top
NOREF#554  -  [Pad_e118]  42.81 23.88 0 top
NOREF#555  -  [Pad_e1184]  35.71 46.36 0 top
NOREF#556  -  [Pad_e1282]  41.28 44.7 0 top
NOREF#557  -  [Pad_e664]  15.49 24.48 0 top
NOREF#558  -  [Pad_e996]  30.36 18.03 0 top
NOREF#559  -  [Pad_e491]  28.04 54.48 0 top
NOREF#560  -  [Pad_e573]  34.54 53.21 0 top
NOREF#561  -  [Pad_e39]  41.67 33.02 0 top
NOREF#562  -  [Pad_e287]  43.82 22.1 0 top
NOREF#563  -  [Pad_e981]  28.81 18.03 0 top
NOREF#564  -  [Pad_e1173]  16.09 20.45 0 top
NOREF#565  -  [Pad_e464]  28.06 56.52 0 top
NOREF#566  -  [Pad_e1385]  15.63 26.29 0 top
NOREF#567  -  [Pad_e1409]  9.79 24.51 0 top
NOREF#568  -  [Pad_e31]  43.17 33.53 0 top
NOREF#569  -  [Pad_e1578]  37.58 18.03 0 top
NOREF#570  -  [Pad_e1437]  9.29 22.48 0 top
NOREF#571  -  [Pad_e937]  30.2 21.97 0 top
NOREF#572  -  [Pad_e1053]  45.32 12.83 0 top
NOREF#573  -  [Pad_e736]  17.78 22.79 0 top
NOREF#574  -  [Pad_e794]  31.37 24.38 0 top
NOREF#575  -  [Pad_e1105]  47.48 12.83 0 top
NOREF#576  -  [Pad_e701]  14.99 23.35 0 top
NOREF#577  -  [Pad_e859]  39.6 20.57 0 top
NOREF#578  -  [Pad_e801]  33.66 24.38 0 top
NOREF#579  -  [Pad_e354]  45.32 18.92 0 top
NOREF#580  -  [Pad_e1532]  29.82 15.49 0 top
NOREF#581  -  [Pad_e458]  40.62 33.66 0 top
NOREF#582  -  [Pad_e361]  42.81 18.92 0 top
NOREF#583  -  [Pad_e1001]  31.36 17.53 0 top
NOREF#584  -  [Pad_e48]  43.17 33.02 0 top
NOREF#585  -  [Pad_e600]  34.52 51.18 0 top
NOREF#586  -  [Pad_e782]  39.62 24.13 0 top
NOREF#587  -  [Pad_e432]  39.6 35.18 0 top
NOREF#588  -  [Pad_e1121]  29.6 26.8 0 top
NOREF#589  -  [Pad_e1352]  20.17 26.29 0 top
NOREF#590  -  [Pad_e1506]  21.71 17.27 0 top
NOREF#591  -  [Pad_e1231]  30.97 55.37 0 top
NOREF#592  -  [Pad_e510]  27.06 52.71 0 top
NOREF#593  -  [Pad_e1049]  43.31 12.83 0 top
NOREF#594  -  [Pad_e1131]  29.1 26.29 0 top
NOREF#595  -  [Pad_e1576]  38.6 18.03 0 top
NOREF#596  -  [Pad_e1468]  22.73 18.8 0 top
NOREF#597  -  [Pad_e304]  42.81 20.07 0 top
NOREF#598  -  [Pad_e723]  17.78 23.04 0 top
NOREF#599  -  [Pad_e995]  29.85 18.03 0 top
NOREF#600  -  [Pad_e1583]  36.58 17.53 0 top
NOREF#601  -  [Pad_e619]  40.62 26.8 0 top
NOREF#602  -  [Pad_e793]  31.12 24.38 0 top
NOREF#603  -  [Pad_e1407]  11.79 25.02 0 top
NOREF#604  -  [Pad_e511]  27.54 52.71 0 top
NOREF#605  -  [Pad_e1106]  47.98 12.83 0 top
NOREF#606  -  [Pad_e1107]  48.49 12.83 0 top
NOREF#607  -  [Pad_e1164]  15.09 20.96 0 top
NOREF#608  -  [Pad_e1342]  20.69 26.8 0 top
NOREF#609  -  [Pad_e1117]  47.48 11.81 0 top
NOREF#610  -  [Pad_e870]  39.12 20.07 0 top
NOREF#611  -  [Pad_e1350]  19.18 26.29 0 top
NOREF#612  -  [Pad_e538]  30.5 53.21 0 top
NOREF#613  -  [Pad_e1102]  45.98 12.83 0 top
NOREF#614  -  [Pad_e1081]  47.48 14.86 0 top
NOREF#615  -  [Pad_e1224]  31.12 49.66 0 top
NOREF#616  -  [Pad_e451]  38.62 34.16 0 top
NOREF#617  -  [Pad_e568]  34.52 53.72 0 top
NOREF#618  -  [Pad_e1085]  46.49 14.35 0 top
NOREF#619  -  [Pad_e1414]  11.8 24 0 top
NOREF#620  -  [Pad_e1423]  10.77 23.5 0 top
NOREF#621  -  [Pad_e1458]  10.29 20.32 0 top
NOREF#622  -  [Pad_e77]  44.82 24.89 0 top
NOREF#623  -  [Pad_e205]  46.49 23.88 0 top
NOREF#624  -  [Pad_e784]  40.11 24.64 0 top
NOREF#625  -  [Pad_e1592]  26.03 32.51 0 top
NOREF#626  -  [Pad_e1075]  47.01 15.37 0 top
NOREF#627  -  [Pad_e277]  47 22.86 0 top
NOREF#628  -  [Pad_e431]  39.12 35.18 0 top
NOREF#629  -  [Pad_e1127]  31.11 26.29 0 top
NOREF#630  -  [Pad_e1145]  31.62 27.81 0 top
NOREF#631  -  [Pad_e95]  43.33 24.89 0 top
NOREF#632  -  [Pad_e591]  33.03 52.2 0 top
NOREF#633  -  [Pad_e145]  42.81 22.86 0 top
NOREF#634  -  [Pad_e923]  29.22 22.99 0 top
NOREF#635  -  [Pad_e1504]  22.73 17.27 0 top
NOREF#636  -  [Pad_e653]  18.03 24.77 0 top
NOREF#637  -  [Pad_e949]  27.33 19.05 0 top
NOREF#638  -  [Pad_e1076]  46.5 15.37 0 top
NOREF#639  -  [Pad_e445]  40.11 34.67 0 top
NOREF#640  -  [Pad_e607]  38.63 27.31 0 top
NOREF#641  -  [Pad_e323]  47 22.1 0 top
NOREF#642  -  [Pad_e127]  44.3 23.37 0 top
NOREF#643  -  [Pad_e840]  39.6 22.61 0 top
NOREF#644  -  [Pad_e1252]  19.68 44.45 0 top
NOREF#645  -  [Pad_e554]  29.98 52.2 0 top
NOREF#646  -  [Pad_e435]  40.11 36.2 0 top
NOREF#647  -  [Pad_e775]  31.37 23.92 0 top
NOREF#648  -  [Pad_e1457]  9.79 20.32 0 top
NOREF#649  -  [Pad_e513]  28.55 52.71 0 top
NOREF#650  -  [Pad_e855]  38.12 21.08 0 top
NOREF#651  -  [Pad_e1405]  10.77 25.02 0 top
NOREF#652  -  [Pad_e379]  44.3 16.89 0 top
NOREF#653  -  [Pad_e1283]  41.79 44.7 0 top
NOREF#654  -  [Pad_e1240]  29.47 54.36 0 top
NOREF#655  -  [Pad_e1379]  17.14 26.8 0 top
NOREF#656  -  [Pad_e646]  48.13 36.94 0 top
NOREF#657  -  [Pad_e1118]  47.98 11.81 0 top
NOREF#658  -  [Pad_e1050]  43.82 12.83 0 top
NOREF#659  -  [Pad_e1140]  30.61 28.32 0 top
NOREF#660  -  [Pad_e381]  45.32 16.89 0 top
NOREF#661  -  [Pad_e294]  43.82 21.08 0 top
NOREF#662  -  [Pad_e972]  30.36 18.54 0 top
NOREF#663  -  [Pad_e975]  31.85 18.54 0 top
NOREF#664  -  [Pad_e1278]  40.77 42.16 0 top
NOREF#665  -  [Pad_e955]  27.79 18.54 0 top
NOREF#666  -  [Pad_e1116]  47 11.81 0 top
NOREF#667  -  [Pad_e375]  42.81 17.4 0 top
NOREF#668  -  [Pad_e1355]  18.68 28.83 0 top
NOREF#669  -  [Pad_e691]  15.75 23.79 0 top
NOREF#670  -  [Pad_e959]  29.85 19.56 0 top
NOREF#671  -  [Pad_e1247]  17.66 44.96 0 top
NOREF#672  -  [Pad_e168]  46.49 25.4 0 top
NOREF#673  -  [Pad_e1028]  44.81 14.86 0 top
NOREF#674  -  [Pad_e1114]  45.98 11.81 0 top
NOREF#675  -  [Pad_e529]  27.06 51.18 0 top
NOREF#676  -  [Pad_e925]  30.2 22.99 0 top
NOREF#677  -  [Pad_e1474]  20.2 18.29 0 top
NOREF#678  -  [Pad_e1159]  15.07 21.46 0 top
NOREF#679  -  [Pad_e709]  17.53 23.35 0 top
NOREF#680  -  [Pad_e1005]  29.36 17.53 0 top
NOREF#681  -  [Pad_e1257]  17.17 44.45 0 top
NOREF#682  -  [Pad_e114]  43.82 23.88 0 top
NOREF#683  -  [Pad_e1094]  46.5 13.84 0 top
NOREF#684  -  [Pad_e738]  26.54 24.26 0 top
NOREF#685  -  [Pad_e436]  40.12 35.69 0 top
NOREF#686  -  [Pad_e1062]  43.82 11.81 0 top
NOREF#687  -  [Pad_e1211]  30.61 50.67 0 top
NOREF#688  -  [Pad_e1084]  45.98 14.35 0 top
NOREF#689  -  [Pad_e1448]  11.28 21.34 0 top
NOREF#690  -  [Pad_e1365]  18.18 28.32 0 top
NOREF#691  -  [Pad_e1255]  18.18 44.45 0 top
NOREF#692  -  [Pad_e1214]  32.11 50.67 0 top
NOREF#693  -  [Pad_e28]  42.18 33.53 0 top
NOREF#694  -  [Pad_e685]  18.03 24.24 0 top
NOREF#695  -  [Pad_e1010]  31.35 17.02 0 top
NOREF#696  -  [Pad_e489]  28.55 54.99 0 top
NOREF#697  -  [Pad_e76]  45.33 24.89 0 top
NOREF#698  -  [Pad_e856]  38.11 20.57 0 top
NOREF#699  -  [Pad_e23]  42.66 34.04 0 top
NOREF#700  -  [Pad_e1213]  31.6 50.67 0 top
NOREF#701  -  [Pad_e1486]  23.23 20.32 0 top
NOREF#702  -  [Pad_e488]  28.04 54.99 0 top
NOREF#703  -  [Pad_e1109]  48 12.32 0 top
NOREF#704  -  [Pad_e279]  45.98 22.86 0 top
NOREF#705  -  [Pad_e1368]  19.18 27.81 0 top
NOREF#706  -  [Pad_e1136]  31.09 25.78 0 top
NOREF#707  -  [Pad_e498]  28.55 53.72 0 top
NOREF#708  -  [Pad_e434]  39.6 36.2 0 top
NOREF#709  -  [Pad_e455]  39.12 33.66 0 top
NOREF#710  -  [Pad_e552]  30.97 52.2 0 top
NOREF#711  -  [Pad_e533]  31.47 53.72 0 top
NOREF#712  -  [Pad_e1523]  29.84 16 0 top
NOREF#713  -  [Pad_e1501]  21.69 17.78 0 top
NOREF#714  -  [Pad_e52]  43.67 33.02 0 top
NOREF#715  -  [Pad_e580]  33.03 52.71 0 top
NOREF#716  -  [Pad_e815]  34.16 21.08 0 top
NOREF#717  -  [Pad_e566]  29.98 51.18 0 top
NOREF#718  -  [Pad_e1422]  10.29 23.5 0 top
NOREF#719  -  [Pad_e1319]  44.33 47.63 0 top
NOREF#720  -  [Pad_e1112]  46.5 12.32 0 top
NOREF#721  -  [Pad_e1009]  30.84 17.02 0 top
NOREF#722  -  [Pad_e1370]  20.17 27.81 0 top
NOREF#723  -  [Pad_e1227]  32.62 49.66 0 top
NOREF#724  -  [Pad_e1006]  29.34 17.02 0 top
NOREF#725  -  [Pad_e7]  41.16 34.04 0 top
NOREF#726  -  [Pad_e740]  39.12 24.64 0 top
NOREF#727  -  [Pad_e371]  44.81 17.4 0 top
NOREF#728  -  [Pad_e1366]  18.17 27.81 0 top
NOREF#729  -  [Pad_e182]  47.48 24.38 0 top
NOREF#730  -  [Pad_e61]  41.67 35.05 0 top
NOREF#731  -  [Pad_e1123]  30.59 26.8 0 top
NOREF#732  -  [Pad_e1452]  10.79 20.83 0 top
NOREF#733  -  [Pad_e1415]  11.3 24 0 top
NOREF#734  -  [Pad_e739]  38.62 24.64 0 top
NOREF#735  -  [Pad_e1187]  35.69 45.85 0 top
NOREF#736  -  [Pad_e1293]  41.3 44.2 0 top
NOREF#737  -  [Pad_e365]  43.31 17.91 0 top
NOREF#738  -  [Pad_e1069]  47.48 15.88 0 top
NOREF#739  -  [Pad_e1418]  9.8 24 0 top
NOREF#740  -  [Pad_e159]  47.49 24.89 0 top
NOREF#741  -  [Pad_e26]  41.67 33.53 0 top
NOREF#742  -  [Pad_e1167]  13.59 20.96 0 top
NOREF#743  -  [Pad_e857]  38.62 20.57 0 top
NOREF#744  -  [Pad_e1054]  45.33 12.32 0 top
NOREF#745  -  [Pad_e1280]  41.76 42.16 0 top
NOREF#746  -  [Pad_e578]  33.04 53.21 0 top
NOREF#747  -  [Pad_e873]  40.62 20.07 0 top
NOREF#748  -  [Pad_e1129]  30.12 26.29 0 top
NOREF#749  -  [Pad_e1396]  11.8 25.53 0 top
NOREF#750  -  [Pad_e686]  16.38 23.79 0 top
NOREF#751  -  [Pad_e1494]  21.72 19.81 0 top
NOREF#752  -  [Pad_e1392]  10.29 26.04 0 top
NOREF#753  -  [Pad_e62]  41.16 35.05 0 top
NOREF#754  -  [Pad_e1270]  42.28 42.67 0 top
NOREF#755  -  [Pad_e961]  30.84 19.56 0 top
NOREF#756  -  [Pad_e1440]  10.29 21.97 0 top
NOREF#757  -  [Pad_e560]  31.47 51.69 0 top
NOREF#758  -  [Pad_e795]  31.62 24.38 0 top
NOREF#759  -  [Pad_e879]  38.11 19.56 0 top
NOREF#760  -  [Pad_e767]  28.83 23.92 0 top
NOREF#761  -  [Pad_e509]  26.55 52.71 0 top
NOREF#762  -  [Pad_e347]  47.98 19.56 0 top
NOREF#763  -  [Pad_e321]  47.49 21.59 0 top
NOREF#764  -  [Pad_e985]  27.33 17.53 0 top
NOREF#765  -  [Pad_e1267]  41.25 43.18 0 top
NOREF#766  -  [Pad_e1314]  43.82 45.21 0 top
NOREF#767  -  [Pad_e316]  47.48 22.1 0 top
NOREF#768  -  [Pad_e1442]  11.28 21.97 0 top
NOREF#769  -  [Pad_e869]  38.62 20.07 0 top
NOREF#770  -  [Pad_e1238]  29.99 54.86 0 top
NOREF#771  -  [Pad_e339]  45.98 20.57 0 top
NOREF#772  -  [Pad_e507]  26.56 53.21 0 top
NOREF#773  -  [Pad_e281]  44.81 22.1 0 top
NOREF#774  -  [Pad_e1402]  9.28 25.02 0 top
NOREF#775  -  [Pad_e1205]  27.57 49.66 0 top
NOREF#776  -  [Pad_e557]  29.98 51.69 0 top
NOREF#777  -  [Pad_e678]  15.75 24.24 0 top
NOREF#778  -  [Pad_e1587]  38.59 17.53 0 top
NOREF#779  -  [Pad_e722]  17.53 23.04 0 top
NOREF#780  -  [Pad_e521]  26.55 51.69 0 top
NOREF#781  -  [Pad_e224]  47.98 23.37 0 top
NOREF#782  -  [Pad_e471]  26.56 56.52 0 top
NOREF#783  -  [Pad_e680]  16.76 24.24 0 top
NOREF#784  -  [Pad_e211]  45.98 23.88 0 top
NOREF#785  -  [Pad_e746]  27.18 24.26 0 top
NOREF#786  -  [Pad_e977]  26.8 18.03 0 top
NOREF#787  -  [Pad_e1264]  39.76 43.18 0 top
NOREF#788  -  [Pad_e327]  46.5 21.59 0 top
NOREF#789  -  [Pad_e1471]  21.23 18.8 0 top
NOREF#790  -  [Pad_e1051]  44.3 12.83 0 top
NOREF#791  -  [Pad_e1384]  15.12 26.29 0 top
NOREF#792  -  [Pad_e359]  43.82 18.92 0 top
NOREF#793  -  [Pad_e844]  38.11 22.1 0 top
NOREF#794  -  [Pad_e1012]  42.81 15.88 0 top
NOREF#795  -  [Pad_e148]  41.66 55.63 0 top
NOREF#796  -  [Pad_e620]  40.11 26.8 0 top
NOREF#797  -  [Pad_e288]  43.31 22.1 0 top
NOREF#798  -  [Pad_e1195]  28.55 50.67 0 top
NOREF#799  -  [Pad_e587]  35.03 52.2 0 top
NOREF#800  -  [Pad_e27]  41.16 33.53 0 top
NOREF#801  -  [Pad_e1311]  42.82 45.72 0 top
NOREF#802  -  [Pad_e1371]  20.68 27.81 0 top
NOREF#803  -  [Pad_e876]  39.6 19.56 0 top
NOREF#804  -  [Pad_e555]  29.47 52.2 0 top
NOREF#805  -  [Pad_e1160]  15.58 21.46 0 top
NOREF#806  -  [Pad_e1585]  37.57 17.53 0 top
NOREF#807  -  [Pad_e978]  27.31 18.03 0 top
NOREF#808  -  [Pad_e970]  29.34 18.54 0 top
NOREF#809  -  [Pad_e749]  27.94 24.26 0 top
NOREF#810  -  [Pad_e1516]  27.82 16.51 0 top
NOREF#811  -  [Pad_e792]  30.86 24.38 0 top
NOREF#812  -  [Pad_e512]  28.04 52.71 0 top
NOREF#813  -  [Pad_e931]  29.74 22.48 0 top
NOREF#814  -  [Pad_e718]  16 23.04 0 top
NOREF#815  -  [Pad_e935]  29.22 21.97 0 top
NOREF#816  -  [Pad_e1008]  30.36 17.02 0 top
NOREF#817  -  [Pad_e456]  39.6 33.66 0 top
NOREF#818  -  [Pad_e1519]  29.31 16.51 0 top
NOREF#819  -  [Pad_e633]  38.11 25.27 0 top
NOREF#820  -  [Pad_e545]  29.98 52.71 0 top
NOREF#821  -  [Pad_e1004]  29.87 17.53 0 top
NOREF#822  -  [Pad_e1467]  22.71 19.3 0 top
NOREF#823  -  [Pad_e1132]  29.09 25.78 0 top
NOREF#824  -  [Pad_e1254]  18.66 44.45 0 top
NOREF#825  -  [Pad_e835]  39.6 23.11 0 top
NOREF#826  -  [Pad_e384]  44.3 16.38 0 top
NOREF#827  -  [Pad_e807]  31.62 21.08 0 top
NOREF#828  -  [Pad_e941]  26.8 19.56 0 top
NOREF#829  -  [Pad_e939]  31.22 21.97 0 top
NOREF#830  -  [Pad_e1518]  28.84 16.51 0 top
NOREF#831  -  [Pad_e842]  38.62 22.61 0 top
NOREF#832  -  [Pad_e508]  26.04 52.71 0 top
NOREF#833  -  [Pad_e1052]  44.81 12.83 0 top
NOREF#834  -  [Pad_e812]  33.4 21.08 0 top
NOREF#835  -  [Pad_e484]  26.04 54.99 0 top
NOREF#836  -  [Pad_e979]  27.79 18.03 0 top
NOREF#837  -  [Pad_e1295]  41.79 43.69 0 top
NOREF#838  -  [Pad_e302]  43.31 20.57 0 top
NOREF#839  -  [Pad_e999]  31.85 18.03 0 top
NOREF#840  -  [Pad_e1344]  19.68 26.8 0 top
NOREF#841  -  [Pad_e732]  16.76 22.79 0 top
NOREF#842  -  [Pad_e639]  38.11 24.64 0 top
NOREF#843  -  [Pad_e330]  47 21.08 0 top
NOREF#844  -  [Pad_e334]  48.49 20.57 0 top
NOREF#845  -  [Pad_e483]  26.04 55.5 0 top
NOREF#846  -  [Pad_e1480]  20.71 20.83 0 top
NOREF#847  -  [Pad_e74]  44.81 25.4 0 top
NOREF#848  -  [Pad_e175]  46.5 24.89 0 top
NOREF#849  -  [Pad_e269]  48.49 22.86 0 top
NOREF#850  -  [Pad_e363]  43.33 18.42 0 top
NOREF#851  -  [Pad_e309]  45.32 20.07 0 top
NOREF#852  -  [Pad_e96]  42.81 24.38 0 top
NOREF#853  -  [Pad_e480]  27.54 55.5 0 top
NOREF#854  -  [Pad_e424]  38.62 36.2 0 top
NOREF#855  -  [Pad_e1463]  20.71 19.3 0 top
NOREF#856  -  [Pad_e785]  40.12 24.13 0 top
NOREF#857  -  [Pad_e1575]  38.59 18.54 0 top
NOREF#858  -  [Pad_e940]  26.3 19.56 0 top
NOREF#859  -  [Pad_e1269]  42.27 43.18 0 top
NOREF#860  -  [Pad_e501]  27.55 53.21 0 top
NOREF#861  -  [Pad_e1337]  18.68 27.31 0 top
NOREF#862  -  [Pad_e21]  41.67 34.04 0 top
NOREF#863  -  [Pad_e1322]  45.82 47.63 0 top
NOREF#864  -  [Pad_e625]  40.11 26.29 0 top
NOREF#865  -  [Pad_e408]  47.48 17.4 0 top
NOREF#866  -  [Pad_e638]  40.62 25.27 0 top
NOREF#867  -  [Pad_e1447]  10.77 21.34 0 top
NOREF#868  -  [Pad_e694]  17.02 23.79 0 top
NOREF#869  -  [Pad_e1292]  41.81 44.2 0 top
NOREF#870  -  [Pad_e809]  32.13 21.08 0 top
NOREF#871  -  [Pad_e1122]  30.11 26.8 0 top
NOREF#872  -  [Pad_e1014]  43.82 15.88 0 top
NOREF#873  -  [Pad_e1022]  43.33 15.37 0 top
NOREF#874  -  [Pad_e1073]  48 15.37 0 top
NOREF#875  -  [Pad_e814]  33.91 21.08 0 top
NOREF#876  -  [Pad_e827]  29.59 21.21 0 top
NOREF#877  -  [Pad_e1000]  31.87 17.53 0 top
NOREF#878  -  [Pad_e982]  28.82 17.53 0 top
NOREF#879  -  [Pad_e1453]  10.31 20.83 0 top
NOREF#880  -  [Pad_e1210]  30.11 50.67 0 top
NOREF#881  -  [Pad_e1521]  30.33 16.51 0 top
NOREF#882  -  [Pad_e472]  26.04 56.01 0 top
NOREF#883  -  [Pad_e214]  45.98 23.37 0 top
NOREF#884  -  [Pad_e752]  28.32 20.77 0 top
NOREF#885  -  [Pad_e1148]  30.12 27.81 0 top
NOREF#886  -  [Pad_e537]  30.98 53.21 0 top
NOREF#887  -  [Pad_e1524]  29.33 16 0 top
NOREF#888  -  [Pad_e319]  48.51 21.59 0 top
NOREF#889  -  [Pad_e171]  39.12 55.6 0 top
NOREF#890  -  [Pad_e200]  47 23.88 0 top
NOREF#891  -  [Pad_e1044]  43.82 13.34 0 top
NOREF#892  -  [Pad_e338]  46.49 20.57 0 top
NOREF#893  -  [Pad_e1048]  42.81 12.83 0 top
NOREF#894  -  [Pad_e1502]  22.2 17.78 0 top
NOREF#895  -  [Pad_e463]  28.57 56.52 0 top
NOREF#896  -  [Pad_e805]  31.12 21.08 0 top
NOREF#897  -  [Pad_e936]  29.73 21.97 0 top
NOREF#898  -  [Pad_e1397]  11.3 25.53 0 top
NOREF#899  -  [Pad_e1487]  22.73 20.32 0 top
NOREF#900  -  [Pad_e1470]  21.71 18.8 0 top
NOREF#901  -  [Pad_e391]  48.51 18.42 0 top
NOREF#902  -  [Pad_e997]  30.84 18.03 0 top
NOREF#903  -  [Pad_e532]  30.97 53.72 0 top
NOREF#904  -  [Pad_e1030]  42.81 14.35 0 top
NOREF#905  -  [Pad_e1261]  18.65 43.94 0 top
NOREF#906  -  [Pad_e1472]  20.72 18.8 0 top
NOREF#907  -  [Pad_e1320]  44.84 47.63 0 top
NOREF#908  -  [Pad_e1082]  47.98 14.86 0 top
NOREF#909  -  [Pad_e953]  26.8 18.54 0 top
NOREF#910  -  [Pad_e470]  26.06 56.52 0 top
NOREF#911  -  [Pad_e1509]  20.22 17.27 0 top
NOREF#912  -  [Pad_e101]  44.3 24.38 0 top
NOREF#913  -  [Pad_e1170]  14.59 20.45 0 top
NOREF#914  -  [Pad_e446]  40.62 34.67 0 top
NOREF#915  -  [Pad_e292]  42.81 21.08 0 top
NOREF#916  -  [Pad_e1190]  37.19 45.85 0 top
NOREF#917  -  [Pad_e402]  47 17.91 0 top
NOREF#918  -  [Pad_e1125]  31.6 26.8 0 top
NOREF#919  -  [Pad_e1158]  14.59 21.46 0 top
NOREF#920  -  [Pad_e1359]  20.68 28.83 0 top
NOREF#921  -  [Pad_e786]  40.63 24.13 0 top
NOREF#922  -  [Pad_e492]  27.54 54.48 0 top
NOREF#923  -  [Pad_e286]  43.84 21.59 0 top
NOREF#924  -  [Pad_e1032]  43.82 14.35 0 top
NOREF#925  -  [Pad_e577]  33.03 53.72 0 top
NOREF#926  -  [Pad_e929]  30.73 22.48 0 top
NOREF#927  -  [Pad_e1150]  29.6 27.31 0 top
NOREF#928  -  [Pad_e524]  28.04 51.69 0 top
NOREF#929  -  [Pad_e1060]  42.81 11.81 0 top
NOREF#930  -  [Pad_e1020]  44.32 15.37 0 top
NOREF#931  -  [Pad_e1483]  22.2 20.83 0 top
NOREF#932  -  [Pad_e753]  28.57 20.77 0 top
NOREF#933  -  [Pad_e1451]  11.3 20.83 0 top
NOREF#934  -  [Pad_e765]  28.32 23.92 0 top
NOREF#935  -  [Pad_e1462]  20.2 19.3 0 top
NOREF#936  -  [Pad_e1201]  28.09 50.17 0 top
NOREF#937  -  [Pad_e789]  40.11 23.62 0 top
NOREF#938  -  [Pad_e837]  40.62 23.11 0 top
NOREF#939  -  [Pad_e422]  46.49 16.38 0 top
NOREF#940  -  [Pad_e450]  39.12 34.16 0 top
NOREF#941  -  [Pad_e779]  38.62 23.62 0 top
NOREF#942  -  [Pad_e448]  40.11 34.16 0 top
NOREF#943  -  [Pad_e1223]  30.61 49.66 0 top
NOREF#944  -  [Pad_e1343]  20.19 26.8 0 top
NOREF#945  -  [Pad_e343]  47.48 20.07 0 top
NOREF#946  -  [Pad_e1065]  45.32 11.81 0 top
NOREF#947  -  [Pad_e401]  46.49 17.91 0 top
NOREF#948  -  [Pad_e849]  40.62 22.1 0 top
NOREF#949  -  [Pad_e86]  42.82 24.89 0 top
NOREF#950  -  [Pad_e407]  47.98 17.4 0 top
NOREF#951  -  [Pad_e1077]  46 15.37 0 top
NOREF#952  -  [Pad_e1488]  22.22 20.32 0 top
NOREF#953  -  [Pad_e1308]  44.32 45.72 0 top
NOREF#954  -  [Pad_e433]  39.62 35.69 0 top
NOREF#955  -  [Pad_e1095]  46 13.84 0 top
NOREF#956  -  [Pad_e1579]  37.11 18.03 0 top
NOREF#957  -  [Pad_e1530]  28.84 15.49 0 top
NOREF#958  -  [Pad_e803]  32.51 21.08 0 top
NOREF#959  -  [Pad_e1445]  9.79 21.34 0 top
NOREF#960  -  [Pad_e766]  28.57 23.92 0 top
NOREF#961  -  [Pad_e284]  44.82 21.59 0 top
NOREF#962  -  [Pad_e1421]  9.79 23.5 0 top
NOREF#963  -  [Pad_e418]  48.49 16.38 0 top
NOREF#964  -  [Pad_e839]  40.11 22.61 0 top
NOREF#965  -  [Pad_e1241]  29.98 54.36 0 top
NOREF#966  -  [Pad_e877]  39.12 19.56 0 top
NOREF#967  -  [Pad_e1498]  20.2 17.78 0 top
NOREF#968  -  [Pad_e1454]  9.8 20.83 0 top
NOREF#969  -  [Pad_e943]  27.79 19.56 0 top
NOREF#970  -  [Pad_e479]  28.04 55.5 0 top
NOREF#971  -  [Pad_e952]  26.3 18.54 0 top
NOREF#972  -  [Pad_e866]  40.62 20.57 0 top
NOREF#973  -  [Pad_e1324]  46.35 47.12 0 top
NOREF#974  -  [Pad_e1219]  31.14 50.17 0 top
NOREF#975  -  [Pad_e416]  47.98 16.89 0 top
NOREF#976  -  [Pad_e1274]  40.28 42.67 0 top
NOREF#977  -  [Pad_e551]  31.47 52.2 0 top
NOREF#978  -  [Pad_e1364]  18.69 28.32 0 top
NOREF#979  -  [Pad_e1217]  32.12 50.17 0 top
NOREF#980  -  [Pad_e773]  30.86 23.92 0 top
NOREF#981  -  [Pad_e439]  40.62 35.18 0 top
NOREF#982  -  [Pad_e973]  30.84 18.54 0 top
NOREF#983  -  [Pad_e695]  17.27 23.79 0 top
NOREF#984  -  [Pad_e499]  28.57 53.21 0 top
NOREF#985  -  [Pad_e514]  28.55 52.2 0 top
NOREF#986  -  [Pad_e758]  30.35 20.77 0 top
NOREF#987  -  [Pad_e971]  29.85 18.54 0 top
NOREF#988  -  [Pad_e1591]  32.77 38.99 0 top
NOREF#989  -  [Pad_e1572]  37.09 18.54 0 top
NOREF#990  -  [Pad_e395]  47 18.92 0 top
NOREF#991  -  [Pad_e754]  28.83 20.77 0 top
NOREF#992  -  [Pad_e440]  40.11 35.18 0 top
NOREF#993  -  [Pad_e659]  16.38 24.77 0 top
NOREF#994  -  [Pad_e394]  47.01 18.42 0 top
NOREF#995  -  [Pad_e1363]  19.2 28.32 0 top
NOREF#996  -  [Pad_e187]  48.49 24.38 0 top
NOREF#997  -  [Pad_e144]  36.58 55.63 0 top
NOREF#998  -  [Pad_e534]  31.98 53.72 0 top
NOREF#999  -  [Pad_e657]  17.02 24.77 0 top
NOREF#1000  -  [Pad_e875]  40.11 19.56 0 top
NOREF#1001  -  [Pad_e944]  28.3 19.56 0 top
NOREF#1002  -  [Pad_e948]  27.81 19.05 0 top
NOREF#1003  -  [Pad_e1199]  29.08 50.17 0 top
NOREF#1004  -  [Pad_e1246]  17.15 44.96 0 top
NOREF#1005  -  [Pad_e308]  44.81 20.07 0 top
NOREF#1006  -  [Pad_e505]  26.04 53.72 0 top
NOREF#1007  -  [Pad_e987]  26.31 17.53 0 top
NOREF#1008  -  [Pad_e1043]  43.31 13.34 0 top
NOREF#1009  -  [Pad_e635]  39.12 25.27 0 top
NOREF#1010  -  [Pad_e1099]  47.48 13.34 0 top
NOREF#1011  -  [Pad_e1581]  36.09 18.03 0 top
NOREF#1012  -  [Pad_e1289]  43.3 44.2 0 top
NOREF#1013  -  [Pad_e1015]  44.3 15.88 0 top
NOREF#1014  -  [Pad_e1110]  47.49 12.32 0 top
NOREF#1015  -  [Pad_e688]  14.99 23.79 0 top
NOREF#1016  -  [Pad_e1260]  18.17 43.94 0 top
NOREF#1017  -  [Pad_e313]  43.82 19.56 0 top
NOREF#1018  -  [Pad_e727]  14.99 22.79 0 top
NOREF#1019  -  [Pad_e1425]  11.79 23.5 0 top
NOREF#1020  -  [Pad_e125]  43.82 23.37 0 top
NOREF#1021  -  [Pad_e191]  31.62 38.99 0 top
NOREF#1022  -  [Pad_e655]  17.53 24.77 0 top
NOREF#1023  -  [Pad_e614]  39.6 27.81 0 top
NOREF#1024  -  [Pad_e808]  31.88 21.08 0 top
NOREF#1025  -  [Pad_e146]  47.48 25.4 0 top
NOREF#1026  -  [Pad_e598]  35.54 51.18 0 top
NOREF#1027  -  [Pad_e1153]  31.09 27.31 0 top
NOREF#1028  -  [Pad_e834]  39.12 23.11 0 top
NOREF#1029  -  [Pad_e1161]  16.09 21.46 0 top
NOREF#1030  -  [Pad_e878]  38.62 19.56 0 top
NOREF#1031  -  [Pad_e670]  17.53 24.48 0 top
NOREF#1032  -  [Pad_e1312]  42.81 45.21 0 top
NOREF#1033  -  [Pad_e583]  34.52 52.71 0 top
NOREF#1034  -  [Pad_e571]  35.55 53.21 0 top
NOREF#1035  -  [Pad_e1391]  9.79 26.04 0 top
NOREF#1036  -  [Pad_e387]  42.81 16.38 0 top
NOREF#1037  -  [Pad_e725]  16.38 22.79 0 top
NOREF#1038  -  [Pad_e276]  47.48 22.86 0 top
NOREF#1039  -  [Pad_e693]  16.76 23.79 0 top
NOREF#1040  -  [Pad_e590]  33.54 52.2 0 top
NOREF#1041  -  [Pad_e821]  27.56 21.21 0 top
NOREF#1042  -  [Pad_e1374]  16.14 27.31 0 top
NOREF#1043  -  [Pad_e1520]  29.82 16.51 0 top
NOREF#1044  -  [Pad_e1361]  20.19 28.32 0 top
NOREF#1045  -  [Pad_e332]  47.98 21.08 0 top
NOREF#1046  -  [Pad_e223]  47.48 23.37 0 top
NOREF#1047  -  [Pad_e661]  14.73 24.48 0 top
NOREF#1048  -  [Pad_e414]  47 16.89 0 top
NOREF#1049  -  [Pad_e1058]  43.33 12.32 0 top
NOREF#1050  -  [Pad_e543]  29.99 53.21 0 top
NOREF#1051  -  [Pad_e1149]  29.61 27.81 0 top
NOREF#1052  -  [Pad_e426]  39.14 35.69 0 top
NOREF#1053  -  [Pad_e1236]  30.98 54.86 0 top
NOREF#1054  -  [Pad_e517]  27.06 52.2 0 top
NOREF#1055  -  [Pad_e1590]  33.28 38.99 0 top
NOREF#1056  -  [Pad_e340]  45.98 20.07 0 top
NOREF#1057  -  [Pad_e1138]  29.6 28.32 0 top
NOREF#1058  -  [Pad_e634]  38.62 25.27 0 top
NOREF#1059  -  [Pad_e333]  48.49 21.08 0 top
NOREF#1060  -  [Pad_e1438]  9.28 21.97 0 top
NOREF#1061  -  [Pad_e72]  43.67 35.05 0 top
NOREF#1062  -  [Pad_e841]  39.12 22.61 0 top
NOREF#1063  -  [Pad_e760]  30.86 20.77 0 top
NOREF#1064  -  [Pad_e386]  43.31 16.38 0 top
NOREF#1065  -  [Pad_e1318]  43.82 47.63 0 top
NOREF#1066  -  [Pad_e210]  13.46 53.59 0 top
NOREF#1067  -  [Pad_e1057]  43.84 12.32 0 top
NOREF#1068  -  [Pad_e816]  28.19 21.21 0 top
NOREF#1069  -  [Pad_e759]  30.61 20.77 0 top
NOREF#1070  -  [Pad_e1142]  31.6 28.32 0 top
NOREF#1071  -  [Pad_e1416]  10.79 24 0 top
NOREF#1072  -  [Pad_e353]  44.81 18.92 0 top
NOREF#1073  -  [Pad_e976]  26.3 18.03 0 top
NOREF#1074  -  [Pad_e348]  47.48 19.56 0 top
NOREF#1075  -  [Pad_e756]  29.34 20.77 0 top
NOREF#1076  -  [Pad_e652]  16 24.77 0 top
NOREF#1077  -  [Pad_e100]  43.82 24.38 0 top
NOREF#1078  -  [Pad_e1245]  31.98 54.36 0 top
NOREF#1079  -  [Pad_e1162]  16.1 20.96 0 top
NOREF#1080  -  [Pad_e1571]  36.58 18.54 0 top
NOREF#1081  -  [Pad_e1]  38.11 36.2 0 top
NOREF#1082  -  [Pad_e644]  49.02 35.56 0 top
NOREF#1083  -  [Pad_e1031]  43.31 14.35 0 top
NOREF#1084  -  [Pad_e861]  39.6 21.59 0 top
NOREF#1085  -  [Pad_e747]  27.43 24.26 0 top
NOREF#1086  -  [Pad_e1288]  43.81 44.2 0 top
NOREF#1087  -  [Pad_e729]  15.49 22.79 0 top
NOREF#1088  -  [Pad_e157]  48 24.89 0 top
NOREF#1089  -  [Pad_e527]  28.04 51.18 0 top
NOREF#1090  -  [Pad_e846]  39.12 22.1 0 top
NOREF#1091  -  [Pad_e420]  47.48 16.38 0 top
NOREF#1092  -  [Pad_e437]  40.63 35.69 0 top
NOREF#1093  -  [Pad_e1460]  11.28 20.32 0 top
NOREF#1094  -  [Pad_e561]  31.98 51.69 0 top
NOREF#1095  -  [Pad_e1266]  40.77 43.18 0 top
NOREF#1096  -  [Pad_e572]  35.04 53.21 0 top
NOREF#1097  -  [Pad_e1176]  36.2 46.86 0 top
NOREF#1098  -  [Pad_e601]  34.04 51.18 0 top
NOREF#1099  -  [Pad_e337]  47 20.57 0 top
NOREF#1100  -  [Pad_e283]  45.33 21.59 0 top
NOREF#1101  -  [Pad_e585]  35.54 52.71 0 top
NOREF#1102  -  [Pad_e597]  35.54 51.69 0 top
NOREF#1103  -  [Pad_e743]  25.91 24.26 0 top
NOREF#1104  -  [Pad_e358]  43.84 18.42 0 top
NOREF#1105  -  [Pad_e862]  40.11 21.59 0 top
NOREF#1106  -  [Pad_e1019]  44.82 15.37 0 top

## Routing (per net, layer and track width the routed paths; a pad name or vN(x,y) marks a point on that pad's centre or on a via; arc(x,y) is an arc through that point)
$2N1346: length 23.9
  Top Layer w0.254: 28.06,35.51 28.06,33.92 32.26,29.72 44.2,29.72 45.47,28.45 J1.1
$2N1350: length 21.8
  Top Layer w0.254: U1.2 28.86,34.42 32.29,30.99 J1.2
$2N1360: length 13.7
  Top Layer w0.254: 35.94,37.08 44.58,37.08 48.13,33.53
$2N1374: length 13.1
  Top Layer w0.254: 35.81,37.85 46.35,37.85 J1.4
$2N1380: length 12.4
  Top Layer w0.254: 35.81,38.74 35.94,38.61 48.13,38.61
$2N1390: length 13
  Top Layer w0.254: 35.81,39.5 46.48,39.5 J1.6
$2N1398: length 13.7
  Top Layer w0.254: 35.81,40.26 44.7,40.26 J1.7
$2N1410: length 14.5
  Top Layer w0.254: 35.81,41.02 42.93,41.02 J1.8
$2N1422: length 17.6
  Top Layer w0.254: 32.13,44.96 35.94,48.77 J1.9
$2N1434: length 19.6
  Top Layer w0.254: 31.24,44.83 37.72,51.31 48.13,51.31
$2N1448: length 19.4
  Top Layer w0.254: 12.83,51.31 23.24,51.31 29.59,44.96
$2N1452: length 17.5
  Top Layer w0.254: 12.83,48.51 25.15,48.51 28.83,44.83
$2N1456: length 15.8
  Top Layer w0.254: J2.3 26.67,46.23 28.06,44.84
$2N1460: length 13.5
  Top Layer w0.254: J2.4 16.16,43.69 17.18,42.67 25.91,42.67
$2N1464: length 13.4
  Top Layer w0.254: J2.5 16.2,41.15 16.97,41.91 25.91,41.91
$2N1472: length 14.1
  Top Layer w0.254: 12.83,38.61 16.13,38.61 18.67,41.15 25.91,41.15
$2N1480: length 14.8
  Top Layer w0.254: J2.7 16.13,36.07 20.32,40.26 25.91,40.26
$2N1488: length 15.3
  Top Layer w0.254: 12.83,33.53 16.13,33.53 21.29,38.69 25.96,38.69
$2N1496: length 16
  Top Layer w0.254: J2.9 16.13,30.99 23.11,37.97 25.91,37.97
$2N1514: length 16.7
  Top Layer w0.254: J2.10 16,28.45 24.65,37.09 25.92,37.09
